# Altium schematic sheet Inverter Main.SchDoc
size B
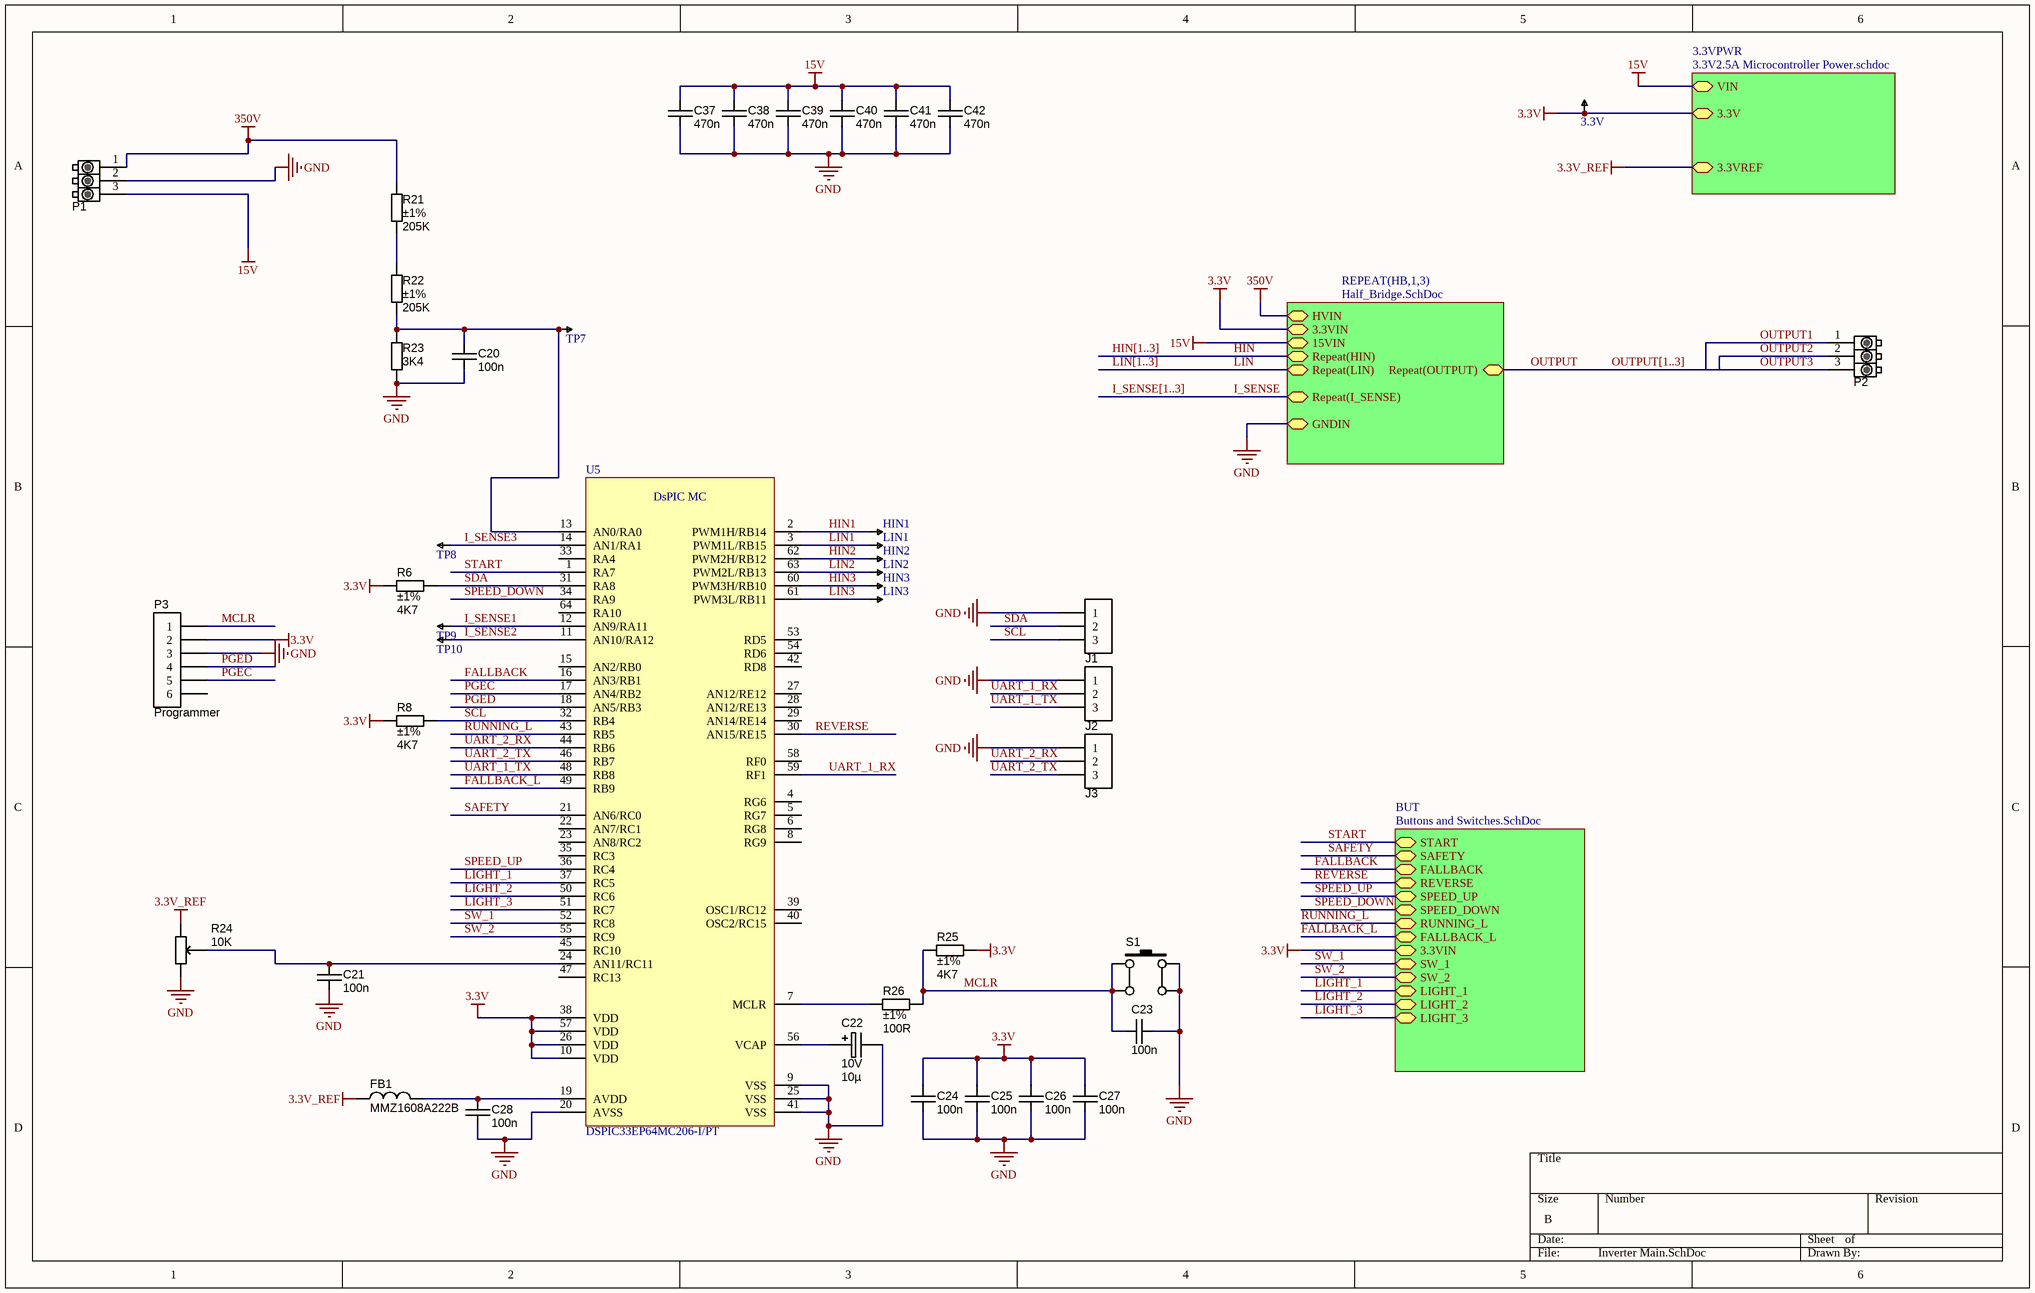
[diagram p0: Inverter Main.SchDoc]

## Parts
3.3V  TESTPOINT SMD 1206  [1206 Test Point]  (value not drawn)
C20  value 100n  [CAPC1608X90N]  (hidden comment: approved sub OK)
C21  value 100n  [CAPC1608X90N]  (hidden comment: approved sub OK)
C22  Ratings: 10V  [CAPMP2012X150USR]  (hidden comment: 10µ)
C23  value 100n  [CAPC1608X90N]  (hidden comment: approved sub OK)
C24  value 100n  [CAPC1608X90N]  (hidden comment: approved sub OK)
C25  value 100n  [CAPC1608X90N]  (hidden comment: approved sub OK)
C26  value 100n  [CAPC1608X90N]  (hidden comment: approved sub OK)
C27  value 100n  [CAPC1608X90N]  (hidden comment: approved sub OK)
C28  value 100n  [CAPC1608X90N]  (hidden comment: approved sub OK)
C37  value 470n  [CAPC2012X135N]  (hidden comment: approved sub OK)
C38  value 470n  [CAPC2012X135N]  (hidden comment: approved sub OK)
C39  value 470n  [CAPC2012X135N]  (hidden comment: approved sub OK)
C40  value 470n  [CAPC2012X135N]  (hidden comment: approved sub OK)
C41  value 470n  [CAPC2012X135N]  (hidden comment: approved sub OK)
C42  value 470n  [CAPC2012X135N]  (hidden comment: approved sub OK)
FB1  Manufacturer Part Number 1: MMZ1608A222B  [FBC1608X95N]  (hidden comment: 2K2 @ 100 MHz)
HIN1  TESTPOINT SMD 1206  [1206 Test Point]  (value not drawn)
HIN2  TESTPOINT SMD 1206  [1206 Test Point]  (value not drawn)
HIN3  TESTPOINT SMD 1206  [1206 Test Point]  (value not drawn)
J1  JST_PH_B3B  [JST_PH_3_B3B]  (value not drawn)
J2  JST_PH_B3B  [JST_PH_3_B3B]  (value not drawn)
J3  JST_PH_B3B  [JST_PH_3_B3B]  (value not drawn)
LIN1  TESTPOINT SMD 1206  [1206 Test Point]  (value not drawn)
LIN2  TESTPOINT SMD 1206  [1206 Test Point]  (value not drawn)
LIN3  TESTPOINT SMD 1206  [1206 Test Point]  (value not drawn)
P1  3P_TERM BLOCK 796739-3  [TE 796739-3 3 Screw Terminal]  (value not drawn)
P2  3P_TERM BLOCK 796739-3  [TE 796739-3 3 Screw Terminal]  (value not drawn)
P3  Programmer  [HDR1X6]  (no BOM)
R6  value 4K7  Tolerance: ±1%  [RESC1608X55N]  (hidden comment: Thick Film)
R8  value 4K7  Tolerance: ±1%  [RESC1608X55N]  (hidden comment: Thick Film)
R21  value 205K  Tolerance: ±1%  [RESC2012X70N]  (hidden comment: Thick Film)
R22  value 205K  Tolerance: ±1%  [RESC2012X70N]  (hidden comment: Thick Film)
R23  value 3K4  [RESC1608X55N]  (hidden comment: Thick Film)
R24  value 10K  [POT_PDB12_BOURNS]  (hidden comment: RES_POT_10K_THT_PDB12-H4251-103BF)
R25  value 4K7  Tolerance: ±1%  [RESC1608X55N]  (hidden comment: Thick Film)
R26  value 100R  Tolerance: ±1%  [RESC1608X55N]  (hidden comment: Thick Film)
S1  TL3301AF160QJ  [SWITCH_TACT_JLEAD_6mm]  (value not drawn)
TP7  TESTPOINT SMD 1206  [1206 Test Point]  (value not drawn)
TP8  TESTPOINT SMD 1206  [1206 Test Point]  (value not drawn)
TP9  TESTPOINT SMD 1206  [1206 Test Point]  (value not drawn)
TP10  TESTPOINT SMD 1206  [1206 Test Point]  (value not drawn)
U5  uC_dsPIC33EP64MC206  [LQFP50P1200X1200X160-64]  (value not drawn)

## Sub-sheets
3.3VPWR = 3.3V2.5A Microcontroller Power.schdoc: VIN, 3.3V, 3.3VREF
BUT = Buttons and Switches.SchDoc: START, SAFETY, FALLBACK, REVERSE, SPEED_DOWN, SPEED_UP, RUNNING_L, FALLBACK_L, 3.3VIN, SW_1, LIGHT_2, LIGHT_1, SW_2, LIGHT_3
REPEAT(HB,1,3) = Half_Bridge.SchDoc: HVIN, 15VIN, GNDIN, Repeat(LIN), Repeat(HIN), Repeat(OUTPUT), 3.3VIN, Repeat(I_SENSE)

## Nets
3.3V: 3.3V.1 C24.1 C25.1 C26.1 C27.1 P3.2 R6.1 R8.1 R25.2 U5.10(VDD) U5.26(VDD) U5.38(VDD) U5.57(VDD) ; sheet REPEAT(HB,1,3)/3.3VIN, sheet 3.3VPWR/3.3V, sheet BUT/3.3VIN
3.3V_REF: FB1.1 R24.1 ; sheet 3.3VPWR/3.3VREF
15V: C37.1 C38.1 C39.1 C40.1 C41.1 C42.1 P1.3 ; sheet REPEAT(HB,1,3)/15VIN, sheet 3.3VPWR/VIN
350V: P1.1 R21.1 ; sheet REPEAT(HB,1,3)/HVIN
GND: C20.2 C21.2 C22.2 C23.2 C24.2 C25.2 C26.2 C27.2 C28.2 C37.2 C38.2 C39.2 C40.2 C41.2 C42.2 J1.1 J2.1 J3.1 P1.2 P3.3 R23.2 R24.3 S1.3 S1.4 U5.9(VSS) U5.20(AVSS) U5.25(VSS) U5.41(VSS) ; sheet REPEAT(HB,1,3)/GNDIN
FALLBACK: U5.16(AN3/RB1) ; sheet BUT/FALLBACK
FALLBACK_L: U5.49(RB9) ; sheet BUT/FALLBACK_L
HIN: sheet REPEAT(HB,1,3)/Repeat(HIN)
HIN1: HIN1.1 U5.2(PWM1H/RB14)
HIN2: HIN2.1 U5.62(PWM2H/RB12)
HIN3: HIN3.1 U5.60(PWM3H/RB10)
I_SENSE: sheet REPEAT(HB,1,3)/Repeat(I_SENSE)
I_SENSE1: TP9.1 U5.12(AN9/RA11)
I_SENSE2: TP10.1 U5.11(AN10/RA12)
I_SENSE3: TP8.1 U5.14(AN1/RA1)
LIGHT_1: U5.37(RC5) ; sheet BUT/LIGHT_1
LIGHT_2: U5.50(RC6) ; sheet BUT/LIGHT_2
LIGHT_3: U5.51(RC7) ; sheet BUT/LIGHT_3
LIN: sheet REPEAT(HB,1,3)/Repeat(LIN)
LIN1: LIN1.1 U5.3(PWM1L/RB15)
LIN2: LIN2.1 U5.63(PWM2L/RB13)
LIN3: LIN3.1 U5.61(PWM3L/RB11)
MCLR: C23.1 P3.1 R25.1 R26.2 S1.1 S1.2
OUTPUT: sheet REPEAT(HB,1,3)/Repeat(OUTPUT)
OUTPUT1: P2.1
OUTPUT2: P2.2
OUTPUT3: P2.3
PGEC: P3.5 U5.17(AN4/RB2)
PGED: P3.4 U5.18(AN5/RB3)
REVERSE: U5.30(AN15/RE15) ; sheet BUT/REVERSE
RUNNING_L: U5.43(RB5) ; sheet BUT/RUNNING_L
SAFETY: U5.21(AN6/RC0) ; sheet BUT/SAFETY
SCL: J1.3 R8.2 U5.32(RB4)
SDA: J1.2 R6.2 U5.31(RA8)
SPEED_DOWN: U5.34(RA9) ; sheet BUT/SPEED_DOWN
SPEED_UP: U5.36(RC4) ; sheet BUT/SPEED_UP
START: U5.1(RA7) ; sheet BUT/START
SW_1: U5.52(RC8) ; sheet BUT/SW_1
SW_2: U5.55(RC9) ; sheet BUT/SW_2
UART_1_RX: J2.2 U5.59(RF1)
UART_1_TX: J2.3 U5.48(RB8)
UART_2_RX: J3.2 U5.44(RB6)
UART_2_TX: J3.3 U5.46(RB7)
NetC20_1: C20.1 R22.2 R23.1 TP7.1 U5.13(AN0/RA0)
NetC21_1: C21.1 R24.2 U5.24(AN11/RC11)
NetC22_1: C22.1 U5.56(VCAP)
NetC28_1: C28.1 FB1.2 U5.19(AVDD)
NetR21_2: R21.2 R22.1
NetR26_1: R26.1 U5.7(MCLR)

Not connected (* = marked no-connect by the designer): P3 6; U5 4(RG6) 5(RG7) 6(RG8) 8(RG9) 15(AN2/RB0) 22(AN7/RC1) 23(AN8/RC2) 27(AN12/RE12) 28(AN12/RE13) 29(AN14/RE14) 33(RA4) 35(RC3) 39(OSC1/RC12) 40(OSC2/RC15) 42(RD8) 45(RC10) 47(RC13) 53(RD5) 54(RD6) 58(RF0) 64(RA10)

## Buses and harness runs
bus HIN[1..3]
bus I_SENSE[1..3]
bus LIN[1..3]
bus OUTPUT[1..3]

## Notes on the sheet
- (in symbol uC_dsPIC33EP64MC206) DsPIC MC

## Library data of the parts
3.3V HIN1-HIN3 LIN1-LIN3 TP7-TP10 = TESTPOINT SMD 1206: Manufacturer: TE Connectivity AMP Connectors; Manufacturer Part Number: RCS-0C; Material - Insulation: No Insulation; Supplier 1: Digi-Key; Supplier Part Number 1: A106143CT-ND; RoHS: RoHS Compliant; Category: Test and Measurement; Stock 1: 28093; Pricing 1: 1=0.28, 10=0.261, 25=0.224, 50=0.1902, 100=0.1828, 250=0.16412, 500=0.15668, 1000=0.13056 (USD); Packaging: Cut Tape (CT); Part Status: Active; Type: PC Test Point; Mounting Type: Surface Mount; Color: Natural; Size / Dimension: 0.126" L x 0.063" W (3.20mm x 1.60mm); Height: 0.049" (1.25mm); Plating: -; Material - Body: -; ComponentLink1URL: http://www.te.com/commerce/DocumentDelivery/DDEController?Action=srchrtrv&DocNm=1773266&DocType=DS&DocLang=English; ComponentLink1Description: http://www.te.com/commerce/DocumentDelivery/DDEController?Action=srchrtrv&DocNm=1773266&DocType=DS&DocLang=English
C20 C21 C23-C28 = CAPC_100n_0603_X7R_50V_10%: Capacitor SMD Cer 100nF 10% 50V X7R 0603; Manufacturer: Murata Electronics North America; Manufacturer Part Number: GRM188R71H104KA93D; Tolerance: ±10%; Supplier 1: Digi-Key; Supplier Part Number 1: 490-1519-1-ND; RoHS: RoHS Compliant; Category: Capacitors; Stock 1: 21293840; Pricing 1: 1=0.12, 10=0.084, 100=0.0396, 500=0.02778, 1000=0.023 (USD); Packaging: Cut Tape (CT); Part Status: Active; Voltage - Rated: 50V; Temperature Coefficient: X7R; Operating Temperature: -55°C ~ 125°C; Features: -; Ratings: -; Applications: General Purpose; Mounting Type: Surface Mount, MLCC; Package / Case: 0603 (1608 Metric); Size / Dimension: 0.063" L x 0.031" W (1.60mm x 0.80mm); Height - Seated (Max): -; Thickness (Max): 0.035" (0.90mm); Lead Spacing: -; Lead Style: -; ComponentLink1URL: http://www.murata.com/~/media/webrenewal/support/library/catalog/products/capacitor/mlcc/c02e.pdf; ComponentLink1Description: http://www.murata.com/~/media/webrenewal/support/library/catalog/products/capacitor/mlcc/c02e.pdf
C22 = CAPT_10u_0805_10V: Capacitor SMD Tantalum 10uF 20% 10V 0805; Manufacturer 1: AVX Corporation; Manufacturer Part Number 1: TAJP106M010RNJ; SCDType: spec; Package / Case: 0805 (2012 metric); Tolerance: ±20%; Material: Tantalum; Supplier 1: Digi-Key; Supplier Part Number 1: 478-3281-1-ND; Value: 10µ
C37-C42 = CAPC_470n_0805_X7R_50V_10%: 0.47µF ±10% 50V Ceramic Capacitor X7R 0805 (2012 Metric); Manufacturer: Murata Electronics North America; Manufacturer Part Number: GRM21BR71H474KA88K; Supplier 1: Digi-Key; Supplier Part Number 1: 490-8319-1-ND; RoHS: RoHS Compliant; Category: Capacitors; Stock 1: 76560; Pricing 1: 1=0.35, 10=0.244, 100=0.1465, 500=0.10986, 1000=0.09278, 2500=0.08789, 5000=0.08301 (USD); Packaging: Cut Tape (CT); Part Status: Active; Tolerance: ±10%; Voltage - Rated: 50V; Temperature Coefficient: X7R; Operating Temperature: -55°C ~ 125°C; Features: -; Ratings: -; Applications: General Purpose; Mounting Type: Surface Mount, MLCC; Package / Case: 0805 (2012 Metric); Size / Dimension: 0.079" L x 0.049" W (2.00mm x 1.25mm); Height - Seated (Max): -; Thickness (Max): 0.053" (1.35mm); Lead Spacing: -; Lead Style: -; ComponentLink1URL: http://search.murata.co.jp/Ceramy/image/img/A01X/G101/ENG/GRM21BR71H474KA88-01.pdf; ComponentLink1Description: http://search.murata.co.jp/Ceramy/image/img/A01X/G101/ENG/GRM21BR71H474KA88-01.pdf
FB1 = FERRITE_2K2-100MHz_0603: Ferrite bead 2.2K Ohm at 100 MHz 200mA 0603 SMD; Manufacturer 1: TDK Corporation; Ratings: 200 mA; 800 mOhm DC; Impedance @ Frequency: 2200 Ohm @ 100MHz; DC Resistance (DCR): 800 mOhm Max; Filter Type: Differential Mode - Single; SCDType: source; Size / Dimension: 0.063" L x 0.031" W (1.60mm x 0.80mm); Current Rating: 200mA; Package / Case: 0603 (1608 Metric); Height (Max): 0.037" (0.95mm); Mounting Type: Surface Mount; Supplier 1: Digi-Key; Supplier Part Number 1: 445-8671-1-ND; RoHS 1: RoHS Compliant; ComponentLink1URL: http://www.tdk.co.jp/tefe02/e9412_mmz.pdf; ComponentLink1Description: http://www.tdk.co.jp/tefe02/e9412_mmz.pdf; Value: 2K2 @ 100 MHz
J1-J3 = JST_PH_B3B: 2mm Pitch; Supplier 1: Digi-Key; Supplier Part Number 1: 455-1705-ND
P1 P2 = 3P_TERM BLOCK 796739-3: 3 Position Wire to Board Terminal Block Horizontal with Board 0.375" (9.53mm) Through Hole; Manufacturer: TE Connectivity AMP Connectors; Number of Levels: 1; Positions Per Level: 3; Current: 30A; Voltage: 600V; Wire Gauge: 10-30 AWG; Wire Termination: Screw - Rising Cage Clamp; Clamp Material - Plating: Brass - Nickel Plated; Torque - Screw: 0.79 Nm (7.0 Lb-In); Screw Thread: M3; Supplier 1: Digi-Key; Supplier Part Number 1: A98274-ND; RoHS: RoHS Compliant; Category: Connectors, Interconnects; Stock 1: 1080; Pricing 1: 1=5.17, 10=3.942, 25=3.692, 50=3.2816, 100=3.2104, 250=2.96064, 500=2.6753, 1000=2.37209, 2500=2.274 (USD); Packaging: Tray; Part Status: Active; Pitch: 0.375" (9.53mm); Mating Orientation: Horizontal with Board; Mounting Type: Through Hole; Features: Interlocking (Side); Color: Green; Operating Temperature: -; Housing Material: Polyamide (PA66), Nylon 6/6; Contact Material - Plating: -; Screw Material - Plating: Brass - Nickel Plated; ComponentLink1URL: http://www.te.com/commerce/DocumentDelivery/DDEController?Action=srchrtrv&DocNm=796739&DocType=Customer+Drawing&DocLang=English; ComponentLink1Description: http://www.te.com/commerce/DocumentDelivery/DDEController?Action=srchrtrv&DocNm=796739&DocType=Customer+Drawing&DocLang=English; Manufacturer Part Number: 796739-3
P3 = Header6P: Header, 6-pin
R6 R8 R25 = RES_4K7_0603_1%: Resistor SMD chip 4.7K Ohm 0.1W 1% 0603; Manufacturer: Yageo; Manufacturer Part Number: RC0603FR-074K7L; Ratings: 1/10W; SCDType: undef; Package / Case: 0603 (1608 Metric); Supplier 1: Digi-Key; Supplier Part Number 1: 311-4.70KHRCT-ND
R21 R22 = RES_205K_0805_1%: Resistor SMD chip 205k Ohm 0.125W 1% 0805; Manufacturer 1: Vishay/Dale; Manufacturer Part Number 1: CRCW0805205KFKEA; Ratings: 1/8W; SCDType: spec; Package / Case: 0805 (2012 metric); Supplier 1: Digi-Key; Supplier Part Number 1: 541-205KCCT-ND
R23 = RES_3K4_0603_1%: Resistor SMD chip 3.4k Ohm 0.1W 1% 0603; Manufacturer: Panasonic Electronic Components; Manufacturer Part Number: ERJ-3EKF3401V; Power (Watts): 0.1W, 1/10W; Temperature Coefficient: ±100ppm/°C; Tolerance: ±1%; Supplier 1: Digi-Key; Supplier Part Number 1: P3.40KHCT-ND; RoHS: RoHS Compliant; Category: Resistors; Stock 1: 108430; Pricing 1: 1=0.1, 10=0.021, 100=0.0087, 1000=0.00389, 2500=0.00338 (USD); Packaging: Cut Tape (CT); Part Status: Active; Composition: Thick Film; Features: Automotive AEC-Q200; Operating Temperature: -55°C ~ 155°C; Package / Case: 0603 (1608 Metric); Supplier Device Package: 0603; Size / Dimension: 0.063" L x 0.031" W (1.60mm x 0.80mm); Height - Seated (Max): 0.022" (0.55mm); Failure Rate: -; ComponentLink1URL: https://industrial.panasonic.com/cdbs/www-data/pdf/RDA0000/AOA0000C304.pdf; ComponentLink1Description: https://industrial.panasonic.com/cdbs/www-data/pdf/RDA0000/AOA0000C304.pdf
R24 = RES_POT_10K_THT_PDB12-H4251-103BF: 10k Ohm 1 Gang Linear Through Hole Potentiometer None 1 Turn Carbon 0.08W PC Pins, Board Locks; Manufacturer: Bourns Inc.; Tolerance: ±20%; Rotation: 300°; Adjustment Type: Top Adjustment; Actuator Type: Flatted; Actuator Length: 0.984" (25.00mm); Actuator Diameter: 0.236" (6.00mm); Supplier 1: Digi-Key; Supplier Part Number 1: PDB12-H4251-103BF-ND; RoHS: RoHS Compliant; Category: Potentiometers, Variable Resistors; Stock 1: 946; Pricing 1: 1=0.92, 10=0.81, 25=0.7292, 50=0.702, 100=0.675, 250=0.63452, 500=0.54, 1000=0.4995, 5000=0.4104 (USD); Packaging: Bulk; Part Status: Active; Taper: Linear; Resistance (Ohms): 10k; Built in Switch: None; Power (Watts): 0.08W; Temperature Coefficient: -; Resistive Material: Carbon; Termination Style: PC Pins, Board Locks; Bushing Thread: -; Mounting Type: Through Hole; ComponentLink1URL: http://www.bourns.com/docs/Product-Datasheets/PDB12.pdf; ComponentLink1Description: http://www.bourns.com/docs/Product-Datasheets/PDB12.pdf; Manufacturer Part Number: PDB12-H4251-103BF
R26 = RES_100R_0603_1%: Resistor SMD chip 100 Ohm 0.1W 1% 0603; Manufacturer 1: Yageo; Manufacturer Part Number 1: RC0603FR-07100RL; Ratings: 1/10 W; SCDType: spec; Package / Case: 0603 (1608 Metric); Material: Thick Film; Supplier 1: Digi-Key; Supplier Part Number 1: 311-100HRCT-ND; Supplier 2: Digi-Key; Supplier Part Number 2: P100HTR-ND; Manufacturer 2: Panasonic - ECG; Manufacturer Part Number 2: ERJ-3EKF1000V; ComponentLink1URL: http://industrial.panasonic.com/www-cgi/jvcr13pz.cgi?E+PZ+3+AOA0002+ERJ3EKF1000V+7+WW; ComponentLink1Description: http://industrial.panasonic.com/www-cgi/jvcr13pz.cgi?E+PZ+3+AOA0002+ERJ3EKF1000V+7+WW
S1 = TACT_SWITCH 6x6 JLEAD TL3301AF160QJ: Manufacturer: E-Switch; Circuit: SPST-NO; Switch Function: Off-Mom; Contact Rating @ Voltage: 0.05A @ 12VDC; Actuator Type: Standard; Actuator Height off PCB, Vertical: 5.00mm; Actuator Orientation: Top Actuated; Outline: 6.00mm x 6.00mm; Illumination: Non-Illuminated; Operating Force: 160gf; Actuator Material: Polyamide (PA), Nylon; Switch Travel: 0.25mm; Mechanical Life: 100,000 Cycles; Supplier 1: Digi-Key; Supplier Part Number 1: EG4374CT-ND; RoHS: RoHS Compliant; Category: Switches; Stock 1: 12724; Pricing 1: 1=0.43, 10=0.41, 25=0.4024, 50=0.387, 100=0.334, 250=0.3036, 500=0.28842 (USD); Packaging: Cut Tape (CT); Part Status: Active; Mounting Type: Surface Mount; Actuator Length, Right Angle: -; Termination Style: J Lead; Illumination Type, Color: -; Illumination Voltage (Nominal): -; Ingress Protection: -; Features: -; Operating Temperature: -20°C ~ 70°C; ComponentLink1URL: https://www.e-switch.com/system/asset/product_line/data_sheet/158/TL3301.pdf; ComponentLink1Description: https://www.e-switch.com/system/asset/product_line/data_sheet/158/TL3301.pdf; Manufacturer Part Number: TL3301AF160QJ
U5 = uC_dsPIC33EP64MC206: DSPIC33EP64MC206-I/PT; Manufacturer: Microchip Technology; Core Processor: dsPIC; Core Size: 16-Bit; Speed: 70 MIPs; Connectivity: I²C, IrDA, LIN, QEI, SPI, UART/USART; Peripherals: Brown-out Detect/Reset, DMA, Motor Control PWM, POR, PWM, WDT; Program Memory Size: 64KB (22K x 24); Program Memory Type: FLASH; RAM Size: 4K x 16; Voltage - Supply (Vcc/Vdd): 3 V ~ 3.6 V; Data Converters: A/D 16x10b/12b; Oscillator Type: Internal; Supplier 1: Digi-Key; Supplier Part Number 1: DSPIC33EP64MC206-I/PT-ND; RoHS: RoHS Compliant; Category: Integrated Circuits (ICs); Stock 1: 6; Pricing 1: 1=3.03, 25=2.7824, 100=2.52 (USD); Packaging: Tray; Part Status: Active; EEPROM Size: -; Operating Temperature: -40°C ~ 85°C (TA); Package / Case: 64-TQFP; Supplier Device Package: 64-TQFP (10x10); ComponentLink1URL: http://www.microchip.com/mymicrochip/filehandler.aspx?ddocname=en556386; ComponentLink1Description: http://www.microchip.com/mymicrochip/filehandler.aspx?ddocname=en556386; Manufacturer Part Number: DSPIC33EP64MC206-I/PT